# Altium schematic sheet A5000_4MB.SchDoc: ARM2 to ARM3 Adapter
size A3; DocumentNumber: 1; SheetNumber: 2; SheetTotal: 5
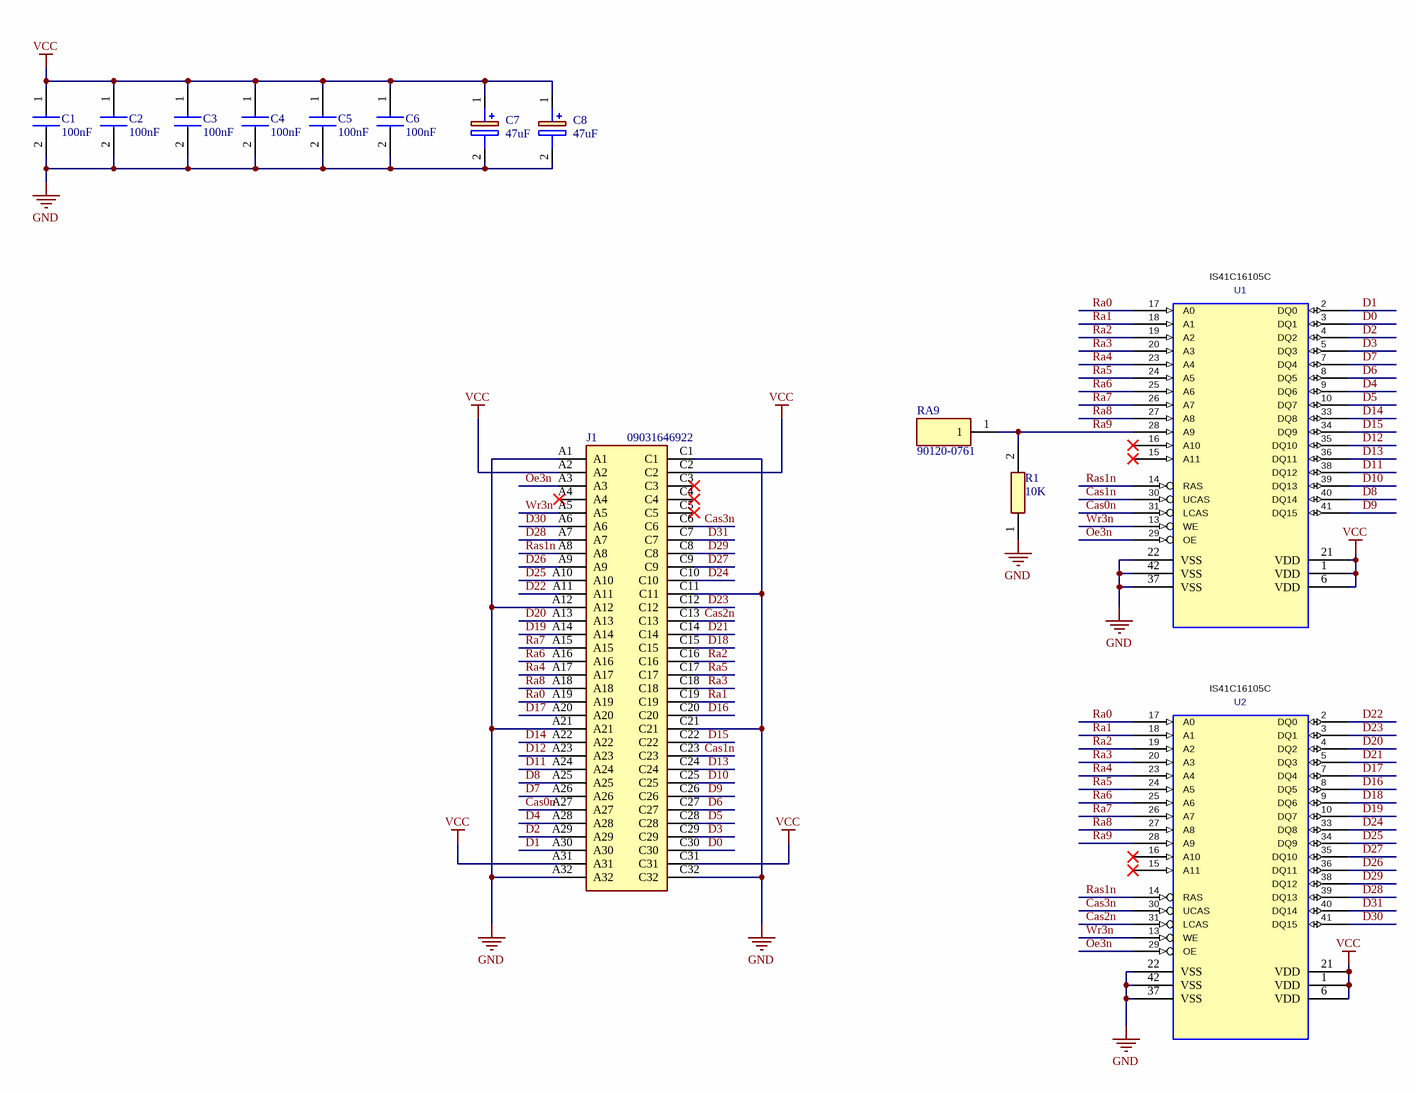
[diagram p0: A5000_4MB.SchDoc]

## Parts
C1  100nF  [0805cap]
C2  100nF  [0805cap]
C3  100nF  [0805cap]
C4  100nF  [0805cap]
C5  100nF  [0805cap]
C6  100nF  [0805cap]
C7  47uF  [EEE1AA101SP]
C8  47uF  [EEE1AA101SP]
J1  09031646922  [09031646922]
R1  10K  [RESC1005X40N]
RA9  90120-0761  [HDRV1W90P0X254_1X1_232X249X560P]
U1  IS41C16105C  [SOJ-42]
U2  IS41C16105C  [SOJ-42]

## Nets
GND: C1.2 C2.2 C3.2 C4.2 C5.2 C6.2 C7.2(-) C8.2(-) J1.A1 J1.A12 J1.A21 J1.A32 J1.C1 J1.C11 J1.C21 J1.C32 R1.1 U1.22(VSS) U1.37(VSS) U1.42(VSS) U2.22(VSS) U2.37(VSS) U2.42(VSS)
VCC: C1.1 C2.1 C3.1 C4.1 C5.1 C6.1 C7.1(+) C8.1(+) J1.A2 J1.A31 J1.C2 J1.C31 U1.1(VCC) U1.6(VCC) U1.21(VCC) U2.1(VCC) U2.6(VCC) U2.21(VCC)
Cas0n: J1.A27 U1.31(LCAS)
Cas1n: J1.C23 U1.30(UCAS)
Cas2n: J1.C13 U2.31(LCAS)
Cas3n: J1.C6 U2.30(UCAS)
D0: J1.C30 U1.3(DQ1)
D1: J1.A30 U1.2(DQ0)
D2: J1.A29 U1.4(DQ2)
D3: J1.C29 U1.5(DQ3)
D4: J1.A28 U1.9(DQ6)
D5: J1.C28 U1.10(DQ7)
D6: J1.C27 U1.8(DQ5)
D7: J1.A26 U1.7(DQ4)
D8: J1.A25 U1.40(DQ14)
D9: J1.C26 U1.41(DQ15)
D10: J1.C25 U1.39(DQ13)
D11: J1.A24 U1.38(DQ12)
D12: J1.A23 U1.35(DQ10)
D13: J1.C24 U1.36(DQ11)
D14: J1.A22 U1.33(DQ8)
D15: J1.C22 U1.34(DQ9)
D16: J1.C20 U2.8(DQ5)
D17: J1.A20 U2.7(DQ4)
D18: J1.C15 U2.9(DQ6)
D19: J1.A14 U2.10(DQ7)
D20: J1.A13 U2.4(DQ2)
D21: J1.C14 U2.5(DQ3)
D22: J1.A11 U2.2(DQ0)
D23: J1.C12 U2.3(DQ1)
D24: J1.C10 U2.33(DQ8)
D25: J1.A10 U2.34(DQ9)
D26: J1.A9 U2.36(DQ11)
D27: J1.C9 U2.35(DQ10)
D28: J1.A7 U2.39(DQ13)
D29: J1.C8 U2.38(DQ12)
D30: J1.A6 U2.41(DQ15)
D31: J1.C7 U2.40(DQ14)
Oe3n: J1.A3 U1.29(OE) U2.29(OE)
Ra0: J1.A19 U1.17(A0) U2.17(A0)
Ra1: J1.C19 U1.18(A1) U2.18(A1)
Ra2: J1.C16 U1.19(A2) U2.19(A2)
Ra3: J1.C18 U1.20(A3) U2.20(A3)
Ra4: J1.A17 U1.23(A4) U2.23(A4)
Ra5: J1.C17 U1.24(A5) U2.24(A5)
Ra6: J1.A16 U1.25(A6) U2.25(A6)
Ra7: J1.A15 U1.26(A7) U2.26(A7)
Ra8: J1.A18 U1.27(A8) U2.27(A8)
Ra9: R1.2 RA9.1 U1.28(A9) U2.28(A9)
Ras1n: J1.A8 U1.14(RAS) U2.14(RAS)
Wr3n: J1.A5 U1.13(WE) U2.13(WE)

Not connected (* = marked no-connect by the designer): J1 A4* C3* C4* C5*; U1 15(A11)* 16(A10)*; U2 15(A11)* 16(A10)*

## Notes on the sheet
- SIZE
- CODION LTD
- DIMENSIONS
- TITLE
- VARIANT
- REVISION
- DATE
- A3
- SHEET
- OF
- FILE
- DRAWN BY

## Library data of the parts
C1-C6 = 100nF0805: Capacitor; Manufacturer_Name: TDK; Manufacturer_Part_Number: C2012X7R1H104K125AM; Datasheet Link: https://product.tdk.com/info/en/catalog/datasheets/mlcc_commercial_midvoltage_en.pdf; Height: 1.45mm; Mouser Part Number: 810-C2012X7R1H104KT5; Mouser Price/Stock: https://www.mouser.com/Search/Refine.aspx?Keyword=810-C2012X7R1H104KT5; Arrow Part Number: C2012X7R1H104K125AM; Arrow Price/Stock: https://www.arrow.com/en/products/c2012x7r1h104k125am/tdk; LCSC Part #: C111492
C7 C8 = EEE1VA470WP: Capacitor Polarised; Manufacturer_Name: Panasonic; Datasheet Link: http://industrial.panasonic.com/cdbs/www-data/pdf/RDE0000/ABA0000C1145.pdf; Height: 7.8mm; Manufacturer_Part_Number: EEE1VA470WP
J1 = 09031646922: Connector; Manufacturer_Name: HARTING; Datasheet Link: https://b2b.harting.com/files/download/PRD/PDF_DS/PDF_DS_09031200201.pdf; Manufacturer_Part_Number: 09031646922; Mouser Part Number: 617-09-03-164-6922; Mouser Price/Stock: https://www.mouser.co.uk/ProductDetail/HARTING/09031646922?qs=UV5Tb6pF94VtKUzITEf3rQ%3D%3D; Arrow Part Number: 09031646922; Arrow Price/Stock: https://www.arrow.com/en/products/09031646922/harting?region=nac
R1 = CRCW040210K0FKEDHP: Resistor; Manufacturer_Name: Vishay; Datasheet Link: http://www.vishay.com/docs/20035/dcrcwe3.pdf; Height: 0.4mm; Manufacturer_Part_Number: CRCW040210K0FKEDHP; Mouser Part Number: 71-CRCW040210K0FKEDH; Mouser Price/Stock: https://www.mouser.co.uk/ProductDetail/Vishay-Dale/CRCW040210K0FKEDHP?qs=FlFvgi4rxBxmIiaeyFjrkA%3D%3D; Arrow Part Number: CRCW040210K0FKEDHP; Arrow Price/Stock: https://www.arrow.com/en/products/crcw040210k0fkedhp/vishay?region=nac; LCSC Part #: C71617
RA9 = 90120-0761: Connector; Manufacturer_Name: Molex; Datasheet Link: https://www.molex.com/pdm_docs/sd/901200761_sd.pdf; Height: 5.6mm; Manufacturer_Part_Number: 90120-0761; Mouser Part Number: 538-90120-0761; Mouser Price/Stock: https://www.mouser.co.uk/ProductDetail/Molex/90120-0761?qs=PvP5v7Eimsn%2F58TpDaAAow%3D%3D
U1 U2 = DRAM_1MX16_SOJ: Value: IS41C16105C